# Altium schematic sheet WIFI.SchDoc
size A
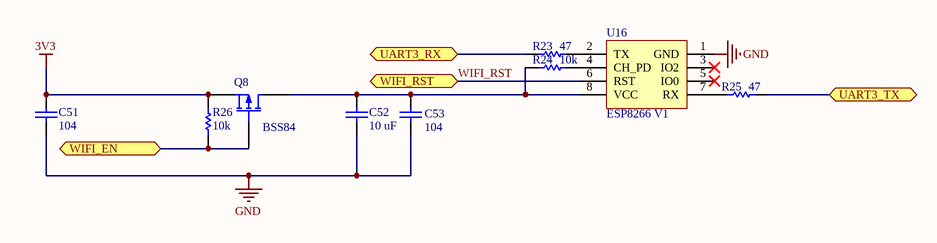
[diagram p0: WIFI.SchDoc]

## Parts
C51  104  [C0603]
C52  10 uF  [C1210]
C53  104  [C0603]
Q8  BSS84  [SOT23-3]
R23  47  [R0603]
R24  10k  [R0603]
R25  47  [R0603]
R26  10k  [R0603]
U16  ESP8266 V1  [ESP8266 MODULE]

## Ports
UART3_RX, UART3_TX, WIFI_EN, WIFI_RST

## Nets
3V3: C51.2 Q8.2(S) R26.1
GND: C51.1 C52.1 C53.1 U16.1(GND)
UART3_RX: R23.1 ; port UART3_RX
UART3_TX: R25.2 ; port UART3_TX
WIFI_EN: Q8.1(G) R26.2 ; port WIFI_EN
WIFI_RST: U16.6(RST) ; port WIFI_RST
NetC52_2: C52.2 C53.2 Q8.3(D) R24.1 U16.8(VCC)
NetR23_2: R23.2 U16.2(TX)
NetR24_2: R24.2 U16.4(CH_PD)
NetR25_1: R25.1 U16.7(RX)

Not connected (* = marked no-connect by the designer): U16 3(IO2)* 5(IO0)*

## Library data of the parts
C51-C53 = Cap_SMT: CAP CER 0.1UF 16V Y5V 0402; Manufacturer: Yageo; Manufacturer Part Number: CC0603ZRY5V7BB104; Published: 8-Jun-2000; LatestRevisionDate: 17-Jul-2002; LatestRevisionNote: Re-released for DXP Platform.; PackageReference: C0603; Publisher: Altium Limited; Digi-Key Part Number: 311-1047-1-ND; Unit Price: 0.00648
  C51 C53: Value: 104
  C52: Value: 10 uF
Q8 = MOSFET-P GSD: MOSFET P-CH 50V 130MA SOT23-3; Manufacturer: Diodes Inc; Manufacturer Part Number: BSS84-7-F; Published: 8-Jun-2000; LatestRevisionDate: 17-Jul-2002; LatestRevisionNote: Re-released for DXP Platform.; PackageVersion: 1995/1996; PackageReference: E3; Publisher: Altium Limited; Digi-Key Part Number: BSS84-FDITR-ND; Unit Price: 0.06000
R23-R26 = R_SMD5: Resistor SMD 5%; Manufacturer: Panasonic Electronic Components; Manufacturer Part Number: ERJ-2RKF3241X; Published: 8-Jun-2000; LatestRevisionDate: 17-Jul-2002; LatestRevisionNote: Re-released for DXP Platform.; PackageReference: R0603; Publisher: Altium Limited; Digi-Key Part Number: P3.24KLTR-ND; Unit Price: 0.00203
  R23 R25: Value: 47
  R24 R26: Value: 10k
U16 = ESP8266 V1: LatestRevisionDate: 17-Jul-2002; LatestRevisionNote: Re-released for DXP Platform.; Publisher: Altium Limited; Digi-Key Part Number: NA